# EAGLE design current_monitor_v1 (EAGLE 6.5.0)
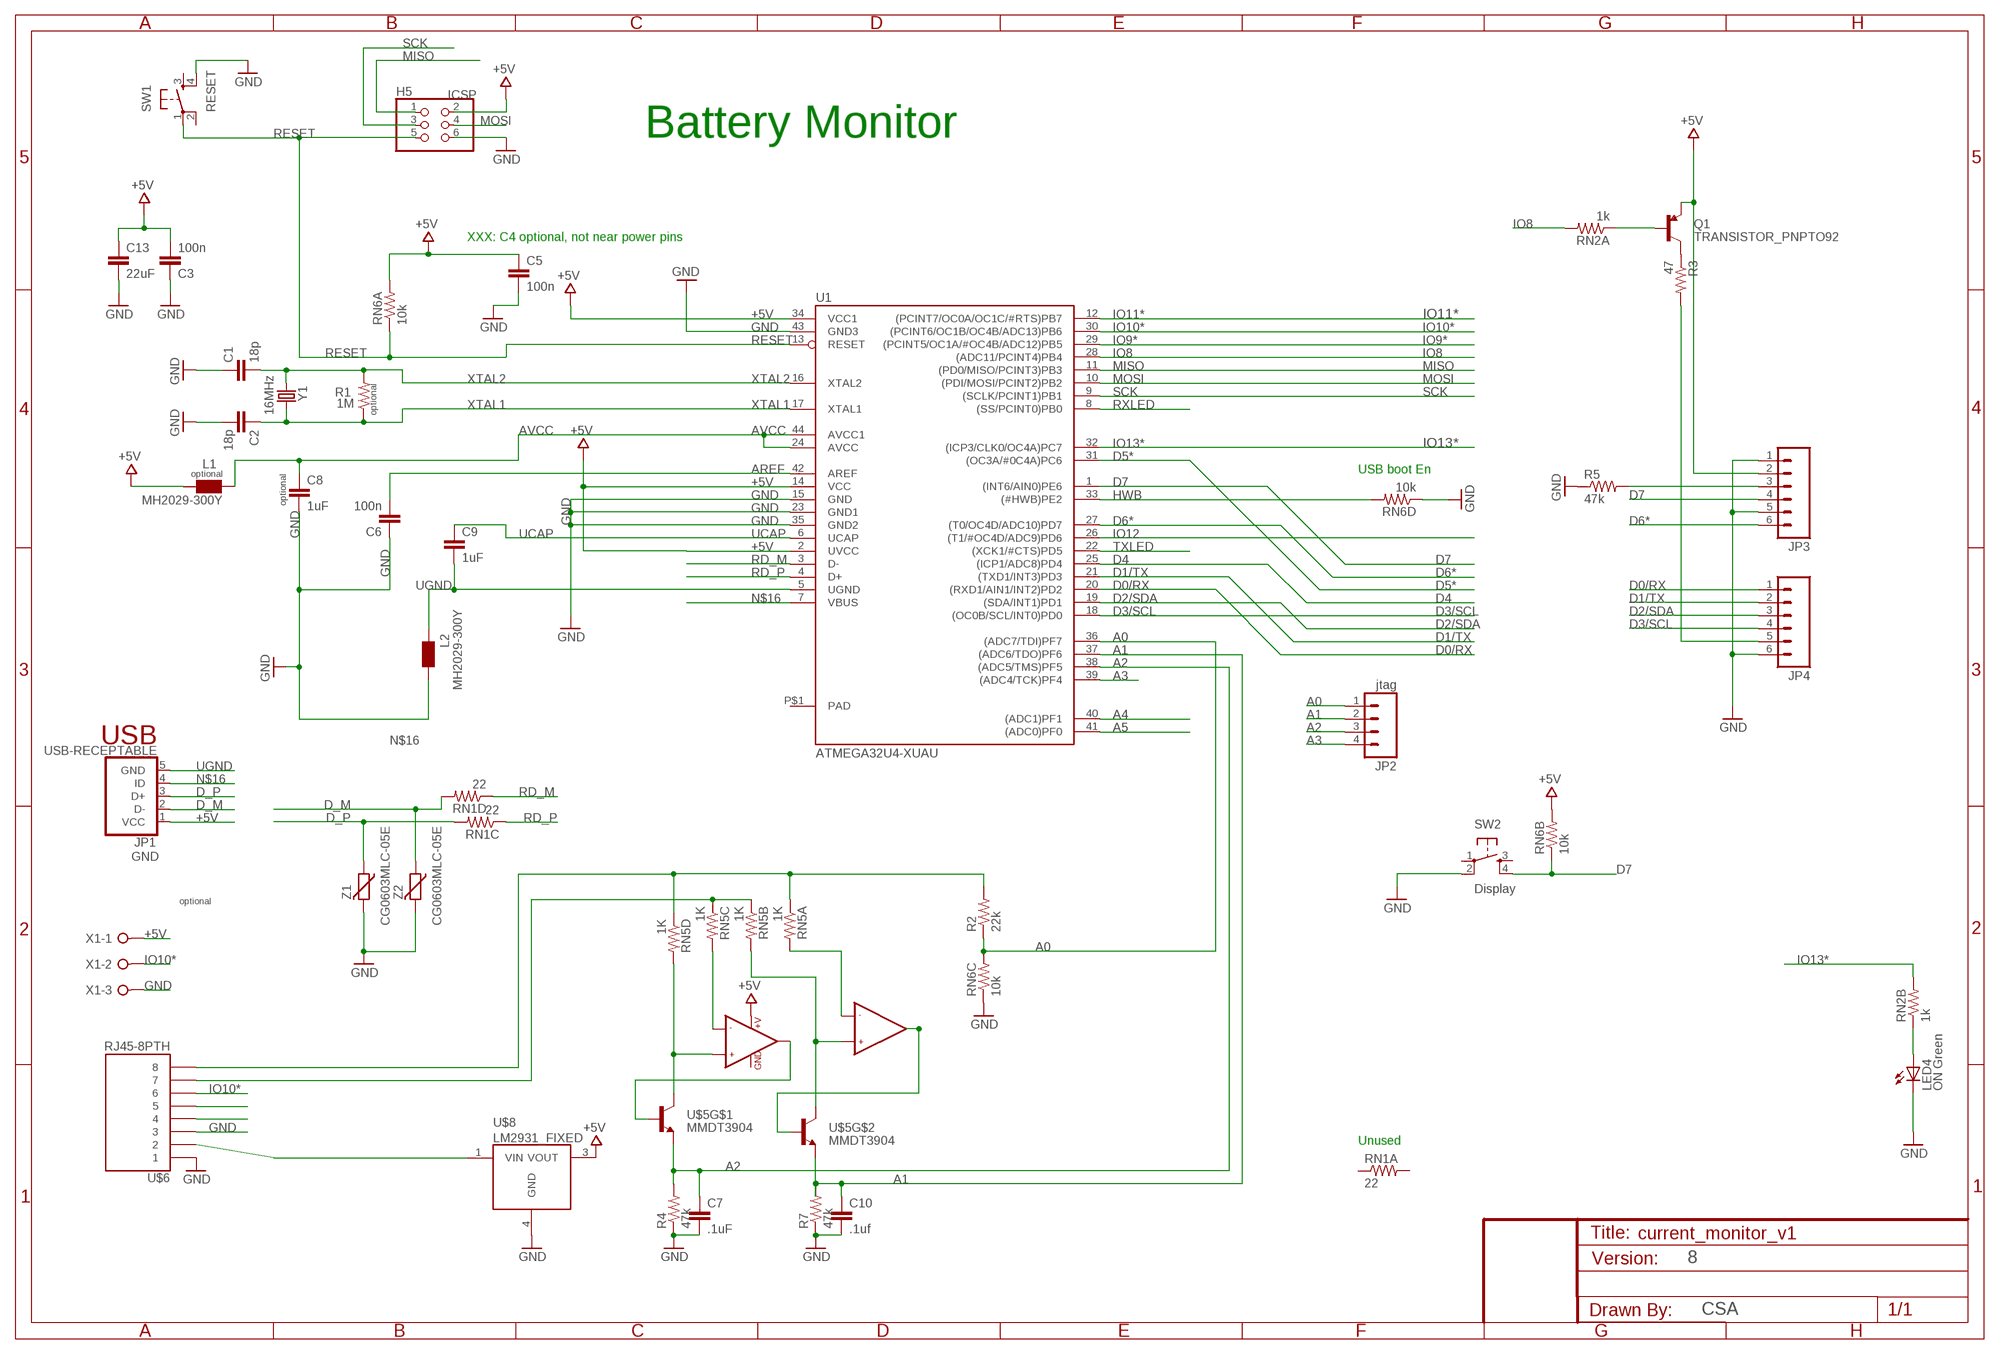
[diagram p0: schematic, sheet 1]

## Parts
C1  18p  CAP0805  [0805]
C2  18p  CAP0805  [0805]
C3  100n  CAP0805  [0805]
C5  100n  CAP0805  [0805]
C6  100n  CAP0805  [0805]
C7  .1uF  CAP0805  [0805]
C8  1uF  CAP0805  [0805]
C9  1uF  CAP0805  [0805]
C10  .1uf  CAP0805  [0805]
C13  22uF  CAP1206  [1206]
H5  ICSP  PINHD-2X3  [2X03]
JP1  USB-RECEPTABLE  [FCI-10103594-0001LF]
JP2  jtag  M04LOCK  [1X04_LOCK]
JP3  M06POGOPIN_HOLES_ONLY  [1X06_HOLES_ONLY]
JP4  M06POGOPIN_HOLES_ONLY  [1X06_HOLES_ONLY]
L1  MH2029-300Y  WE-CBF_0805  [0805]
L2  MH2029-300Y  WE-CBF_0805  [0805]
LED4  ON Green  LED0805  [LED0805]
Q1  TRANSISTOR_PNPTO92  [TO-92]
R1  1M  RESISTOR0805-RES  [0805]
R2  22k  RESISTOR0805-RES  [0805]
R3  47  R-US_0207/15  [0207/15]
R4  47k  RESISTOR0805-RES  [0805]
R5  47k  RESISTOR0805-RES  [0805]
R7  47k  RESISTOR0805-RES  [0805]
RN1  22  RESISTOR-ARRAYCRA06S  [CRA06S]
RN2  1k  RESISTOR-ARRAYCRA06S  [CRA06S]
RN5  1K  RESISTOR-ARRAYCRA06S  [CRA06S]
RN6  10k  RESISTOR-ARRAYCRA06S  [CRA06S]
SW1  RESET  TAC_SWITCHPTH  [TACTILE-PTH]
SW2  Display  TAC_SWITCHPTH  [TACTILE-PTH]
U1  ATMEGA32U4-XUAU  [TQFP44-PAD]
U$2  LMV358  [SO08]
U$5  MMDT3904  [SOT363]
U$6  RJ45-8PTH  [RJ45-8]
U$8  LM2931_FIXED  [DPAK]
X1  W237-03P  [W237-133]
Y1  16MHz  CRYSTALHC49US  [HC49US]
Z1  CG0603MLC-05E  VARISTORCN0603  [CT/CN0603]
Z2  CG0603MLC-05E  VARISTORCN0603  [CT/CN0603]

## Nets
+5V [power]: C3.2 C5.1 C13.1 H5.2 JP1.1(VCC) JP3.2 L1.1 Q1.1(E) RN6.7 RN6.8 U1.2(UVCC) U1.14(VCC) U1.34(VCC1) U$2.8(+V) U$8.3(VOUT) X1.1
A0: JP2.1 R2.1 RN6.6 U1.36((ADC7/TDI)PF7)
A1: C10.1 JP2.2 R7.2 U1.37((ADC6/TDO)PF6) U$5.1(E)
A2: C7.1 JP2.3 R4.2 U1.38((ADC5/TMS)PF5) U$5.4(E)
A3: JP2.4 U1.39((ADC4/TCK)PF4)
A4: U1.40((ADC1)PF1)
A5: U1.41((ADC0)PF0)
AREF [aref]: C6.2 U1.42(AREF)
AVCC: C8.1 L1.2 U1.24(AVCC) U1.44(AVCC1)
D0/RX: JP4.1 U1.20((RXD1/AIN1/INT2)PD2)
D1/TX: JP4.2 U1.21((TXD1/INT3)PD3)
D2/SDA: JP4.3 U1.19((SDA/INT1)PD1)
D3/SCL: JP4.4 U1.18((OC0B/SCL/INT0)PD0)
D4: U1.25((ICP1/ADC8)PD4)
D5*: U1.31((OC3A/#0C4A)PC6)
D6*: JP3.6 U1.27((T0/OC4D/ADC10)PD7)
D7: JP3.4 RN6.2 SW2.4 U1.1((INT6/AIN0)PE6)
D_M: JP1.2(D-) RN1.5 Z2.1
D_P: JP1.3(D+) RN1.6 Z1.1
GND [gnd]: C1.1 C2.2 C3.1 C5.2 C6.1 C7.2 C8.2 C10.2 C13.2 H5.6 JP3.1 JP3.5 JP4.6 L2.2 LED4.C R4.1 R5.1 R7.1 RN6.3 RN6.4 SW1.4 SW2.2 U1.15(GND) U1.23(GND1) U1.35(GND2) U1.43(GND3) U$6.1 U$6.3 U$8.4(GND) X1.3 Z1.2 Z2.2
HWB: RN6.5 U1.33((#HWB)PE2)
IO8: RN2.8 U1.28((ADC11/PCINT4)PB4)
IO9*: U1.29((PCINT5/OC1A/#OC4B/ADC12)PB5)
IO10*: U1.30((PCINT6/OC1B/OC4B/ADC13)PB6) U$6.6 X1.2
IO11*: U1.12((PCINT7/OC0A/OC1C/#RTS)PB7)
IO12: U1.26((T1/#OC4D/ADC9)PD6)
IO13*: RN2.7 U1.32((ICP3/CLK0/OC4A)PC7)
LED4_ANODE: LED4.A RN2.2
MISO: H5.1 U1.11((PD0/MISO/PCINT3)PB3)
MOSI: H5.4 U1.10((PDI/MOSI/PCINT2)PB2)
N$1: RN5.5 U$2.3(+IN1) U$5.3(C)
N$2: RN5.8 U$2.6(-IN2)
N$3: RN5.7 U$2.5(+IN2) U$5.6(C)
N$4: U$2.1(OUT1) U$5.5(B)
N$5: U$2.7(OUT2) U$5.2(B)
N$6: RN5.6 U$2.2(-IN1)
N$7: R2.2 RN5.1 RN5.4 U$6.8
N$8: RN5.2 RN5.3 U$6.7
N$10: Q1.3(C) R3.1
N$12: JP3.3 R5.2
N$13: JP4.5 R3.2
N$16 [power]: JP1.4(ID) U1.7(VBUS)
N$18: U$6.2 U$8.1(VIN)
N$19: Q1.2(B) RN2.1
N$20: U$6.5
N$31 [gnd]: U$6.4
RD_M: RN1.4 U1.3(D-)
RD_P: RN1.3 U1.4(D+)
RESET: H5.5 RN6.1 SW1.1 U1.13(RESET)
RXLED: U1.8((SS/PCINT0)PB0)
SCK: H5.3 U1.9((SCLK/PCINT1)PB1)
TXLED: U1.22((XCK1/#CTS)PD5)
UCAP: C9.1 U1.6(UCAP)
UGND [gnd]: C9.2 JP1.5(GND) L2.1 U1.5(UGND)
XTAL1: C2.1 R1.1 U1.17(XTAL1) Y1.2
XTAL2: C1.2 R1.2 U1.16(XTAL2) Y1.1
Unconnected: RN1.1 RN1.2 RN1.7 RN1.8 RN2.3 RN2.4 RN2.5 RN2.6 SW1.2 SW1.3 SW2.1 SW2.3

## Notes on the sheet
- Battery Monitor
- XXX: C4 optional, not near power pins
- optional
- USB boot En
- optional
- optional
- USB
- optional
- Unused
- 8
- CSA

## Power pins joined to a net without a drawn wire
GND: U$2.4(GND)
PAD: U1.P$1(PAD)

## Library data of the parts
C1-C3 C5 C6 C8 C9 C13 = SparkFun-Passives:CAP: Capacitor Standard 0603 ceramic capacitor, and 0.1" leaded capacitor.
C7 C10 = SparkFun-Capacitors:CAP: Capacitor Standard 0603 ceramic capacitor, and 0.1" leaded capacitor.
H5 = SmartPrj:PINHD-2X3: PIN HEADER
JP1 = daspilker:USB-RECEPTABLE: USB Receptable
JP2 = SparkFun-Connectors:M04: Header 4 Standard 4-pin 0.1" header. Use with straight break away headers (SKU : PRT-00116), right angle break away headers (PRT-00553), swiss pins (PRT-00743), machine pins (PRT-00117), and female headers (PRT-00115). Molex polarized connector foot print use with SKU : PRT-08231 with associated crimp pins and housings. 1MM SMD Version SKU: PRT-10208
JP3 JP4 = SparkFun-Connectors:M06: Header 6 Standard 6-pin 0.1" header. Use with straight break away headers (SKU : PRT-00116), right angle break away headers (PRT-00553), swiss pins (PRT-00743), machine pins (PRT-00117), and female headers (PRT-00115). Molex polarized connector foot print use with SKU : PRT-08094 with associated crimp pins and housings. NOTES ON THE VARIANTS LOCK and LOCK_LONGPADS... This footprint was designed to help hold the alignment of a through-hole component (i.e. 6-pin header) while soldering it into place. You may notice that each hole has been shifted either up or down by 0.005 of an inch from it's more standard position (which is a perfectly straight line). This slight alteration caused the pins (the squares in the middle) to touch the edges of the holes. Because they are alternating, it causes a "brace" to hold the component in place. 0.005 has proven to be the perfect amount of "off-center" position when using our standard breakaway headers. Although looks a little odd when you look at the bare footprint, once you have a header in there, the alteration is very hard to notice. Also, if you push a header all the way into place, it is covered up entirely on the bottom side. This idea of altering the position of holes to aid alignment will be further integrated into the Sparkfun Library for other footprints. It can help hold any component with 3 or more connection pins.
L1 L2 = wuerth-elektronik:WE-CBF: SMD EMI Suppression Ferrite Beads - excellent anti-EMI properties - low DCR - impedances till 3000 ohms - rated current up to 6 A
LED4 = xorduino:LED
Q1 = SparkFun-DiscreteSemi:TRANSISTOR_PNP: Generic PNP BJT. Double check pinouts against datasheets- not all devices are the same!
R1 R2 R4 R5 R7 = SparkFun-Passives:RESISTOR: Resistor Basic schematic elements and footprints for 0603, 1206, and PTH resistors.
R3 = adafruit:R-US_: RESISTOR, American symbol
RN1 RN2 RN5 RN6 = xorduino:RESISTOR-ARRAY
SW1 SW2 = SparkFun-Electromechanical:TAC_SWITCH: Momentary Switch Button commonly used for reset or general input. Spark Fun Electronics SKU : COM-00097
U1 = SmartPrj:ATMEGA32U4-XU
U$2 = SparkFun-AnalogIC:LMV358: Jellybean rail-to-rail output op-amp
U$5 = SparkFun-DiscreteSemi:MMDT3904: Dual NPN transistor
U$6 = SparkFun-Connectors:RJ45-8: RJ45 Jack Simple RJ45, 8-pin connection - connector for common Cat5, Cat5e, and Cat6 Ethernet cables. Footprint not yet proven in production. Connector sku is PRT-00643; Breakout PCB sku is BOB-00716.
U$8 = SparkFun-PowerIC:LM2931_FIXED: LDO regulator with reverse battery protection- very durable!
X1 = con-wago-508:W237-03P: WAGO SREW CLAMP; OC_FARNELL: unknown; OC_NEWARK: unknown
Y1 = SparkFun-FreqCtrl:CRYSTAL: Various standard crystals. Proven footprints. Spark Fun Electronics SKU : COM-00534
Z1 Z2 = varistor:VARISTOR: VARISTOR

## Net classes
0 default: width 0.203 mm, drill 0.406 mm, clearance 0.203 mm
1 power: width 0.203 mm, drill 0.406 mm, clearance 0.203 mm
2 gnd: width 0.203 mm, drill 0.406 mm, clearance 0.203 mm
3 usbvcc: width 0.203 mm, drill 0.406 mm, clearance 0.203 mm
4 aref: width 0.203 mm, drill 0.406 mm, clearance 0.203 mm

## Board
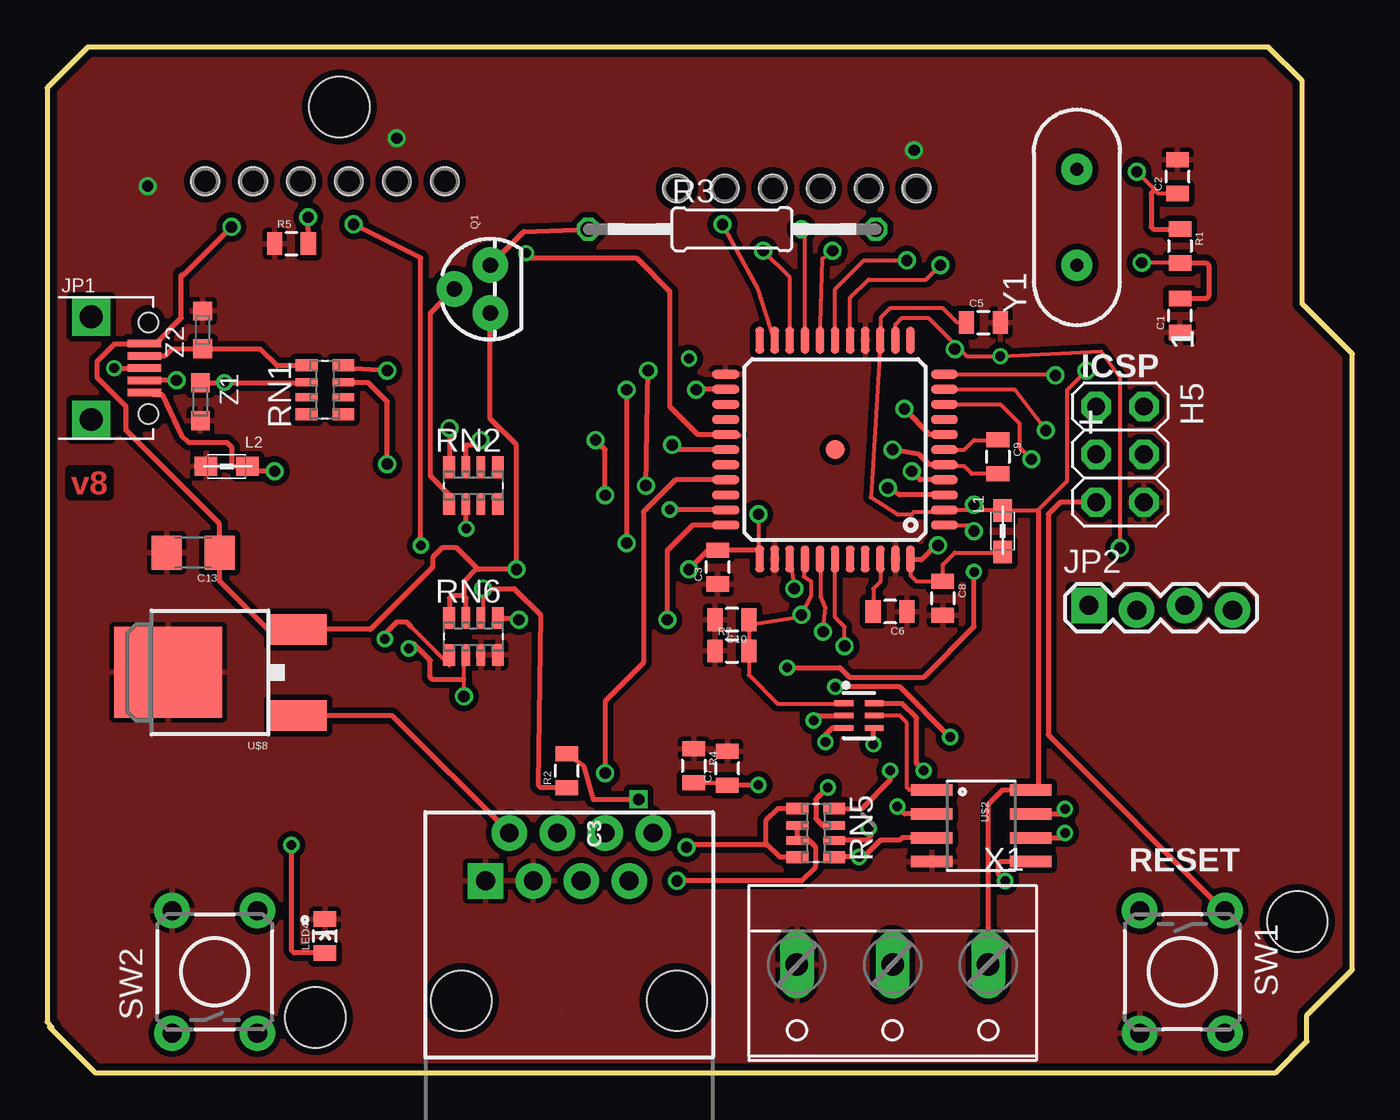
[diagram p1: board, top side]
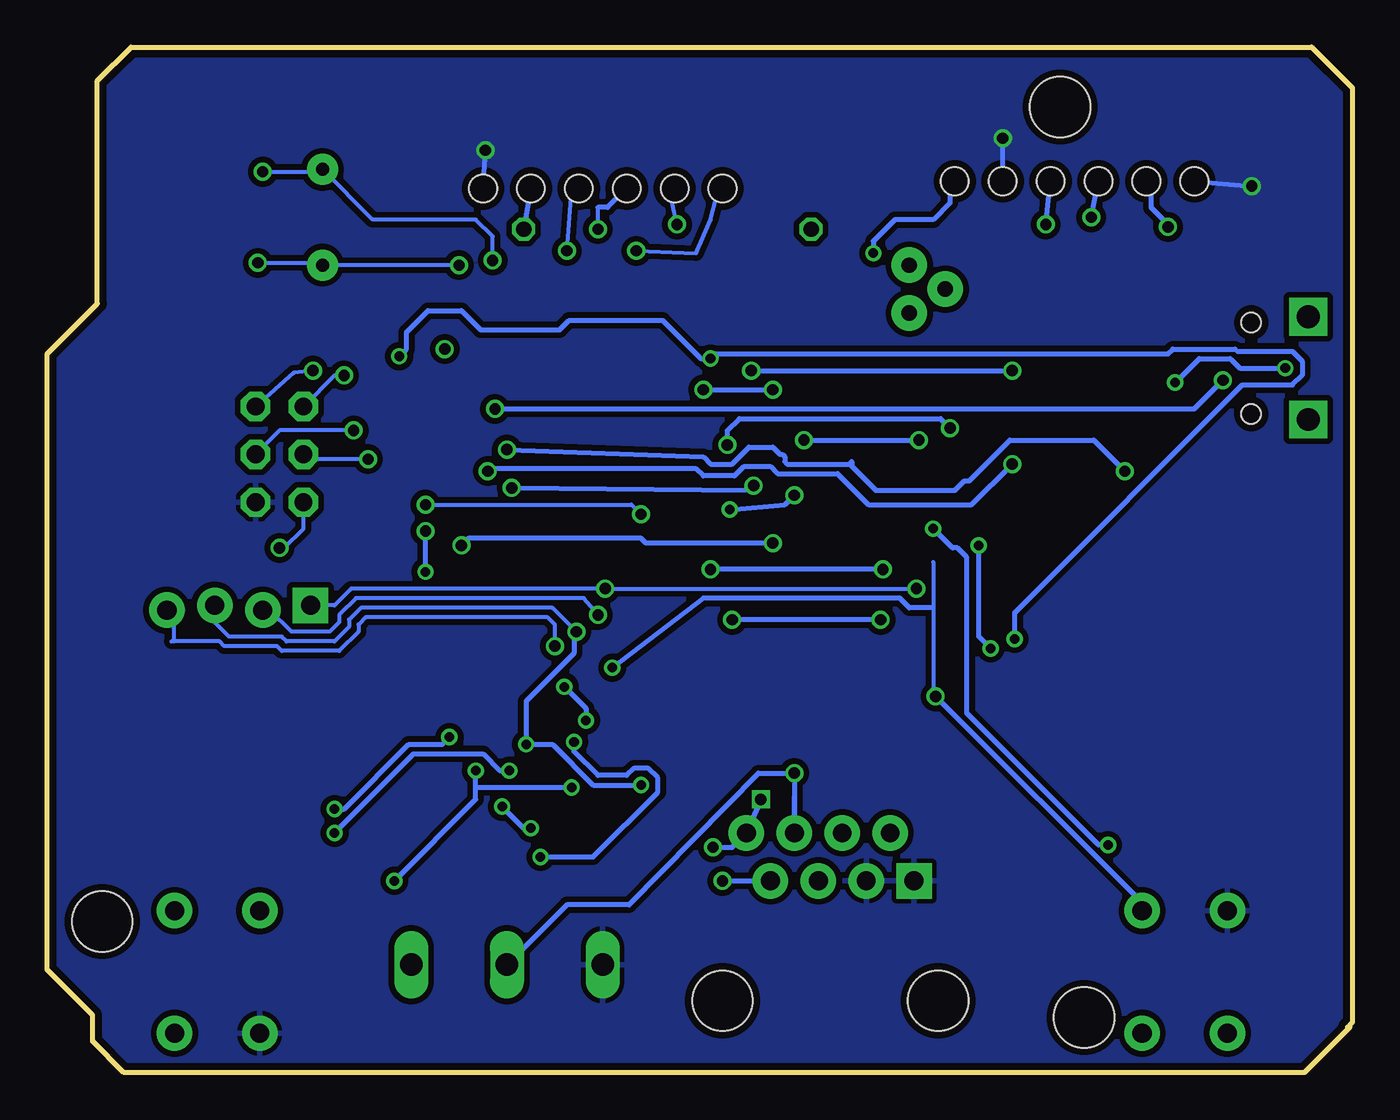
[diagram p2: board, bottom side, seen from below]

Size 69.22 x 54.36 mm. Coordinates in mm from the lower left corner, seen from the top.
Outline: 0.13,2.54 0.13,2.41 2.54,0 65.15,0 66.8,1.65 66.8,3.05 69.22,5.46 69.22,38.1 66.55,40.77 66.55,52.58 64.77,54.36 2.16,54.36 0,52.2 0,2.67 0.25,2.41
Copper layers (1*16): Top 0.0356mm / dielectric 1.5011mm / Bottom 0.0356mm
Design rules "LaenPCBOrder": minimum track width 6mil, minimum drill 13mil, track to track 6mil, track to pad 6mil, pad to pad 6mil, via to via 6mil, smd to smd 6mil, copper to edge 15mil, drill to drill 6mil, minimum pad ring 7mil, minimum via ring 7mil, stop-mask expansion 4mil, vias tented up to drill 0mil, thermal gap 10mil
Holes 3.2 mm at 66.29,8 15.49,51.18 14.22,2.92
tKeepout: area 32.1,28.2 to 62,50.4; area 38,21.7 to 64.4,28.6

### Footprints (pad centres in the part's own frame; a part is rotated, then mirrored left to right if it is on the bottom)
0805 = smd 0.8 x 1.2: 1 -0.9,0; 2 0.9,0
1206 = smd 1.6 x 1.8: 1 -1.4,0; 2 1.4,0
2X03 = drill 0.95 pad 1.55 octagon: 1 -2.54,-1.27; 2 -2.54,1.27; 3 0,-1.27; 4 0,1.27; 5 2.54,-1.27; 6 2.54,1.27
FCI-10103594-0001LF = smd 0.4 x 1.75: 1 -1.3,4.525; 2 -0.65,4.525; 3 0,4.525; 4 0.65,4.525; 5 1.3,4.525 | drill 1.2 pad 2 square: P$3 -2.725,1.7; P$4 2.725,1.7 | hole 1.05: -2.425,4.73; 2.425,4.73
1X04_LOCK = drill 1.016 pad 1.88 square: 1 0,0.127 | drill 1.016 pad 1.88: 2 2.54,-0.127; 3 5.08,0.127; 4 7.62,-0.127
1X06_HOLES_ONLY = drill 0.889 pad 0.813: 1 0,0; 2 2.54,0; 3 5.08,0; 4 7.62,0; 5 10.16,0; 6 12.7,0 | hole 1.473: 0,0; 2.54,0; 5.08,0; 7.62,0; 10.16,0; 12.7,0
0805' = smd 1.2 x 1: 1 -1.1,0; 2 1.1,0
LED0805 = smd 0.8 x 1.2: A -0.9,0; C 0.9,0
TO-92 = drill 0.813 pad 1.88: 1 -1.27,0; 2 0,1.905; 3 1.27,0
0207/15 = drill 0.813 octagon: 1 -7.62,0; 2 7.62,0
CRA06S = smd 0.63 x 1.15: 1 -1.295,-0.975; 4 1.295,-0.975; 5 1.295,0.975; 8 -1.295,0.975 | smd 0.44 x 1.15: 2 -0.4,-0.975; 3 0.4,-0.975; 6 0.4,0.975; 7 -0.4,0.975
TACTILE-PTH = drill 1.016 pad 1.88: 1 -3.251,2.261; 2 3.251,2.261; 3 -3.251,-2.261; 4 3.251,-2.261
TQFP44-PAD = smd 1.4 x 0.45: 1 -5.8,4; 2 -5.8,3.2; 3 -5.8,2.4; 4 -5.8,1.6; 5 -5.8,0.8; 6 -5.8,0; 7 -5.8,-0.8; 8 -5.8,-1.6; 9 -5.8,-2.4; 10 -5.8,-3.2; 11 -5.8,-4; 23 5.8,-4; 24 5.8,-3.2; 25 5.8,-2.4; 26 5.8,-1.6; 27 5.8,-0.8; 28 5.8,0; 29 5.8,0.8; 30 5.8,1.6; 31 5.8,2.4; 32 5.8,3.2; 33 5.8,4 | smd 0.45 x 1.4: 12 -4,-5.8; 13 -3.2,-5.8; 14 -2.4,-5.8; 15 -1.6,-5.8; 16 -0.8,-5.8; 17 0,-5.8; 18 0.8,-5.8; 19 1.6,-5.8; 20 2.4,-5.8; 21 3.2,-5.8; 22 4,-5.8; 34 4,5.8; 35 3.2,5.8; 36 2.4,5.8; 37 1.6,5.8; 38 0.8,5.8; 39 0,5.8; 40 -0.8,5.8; 41 -1.6,5.8; 42 -2.4,5.8; 43 -3.2,5.8; 44 -4,5.8 | smd 1 x 1: P$1 0,0
SO08 = smd 0.61 x 2.21: 1 -1.905,-2.616; 2 -0.635,-2.616; 3 0.635,-2.616; 4 1.905,-2.616; 5 1.905,2.616; 6 0.635,2.616; 7 -0.635,2.616; 8 -1.905,2.616
SOT363 = smd 0.3 x 0.99: 1 -0.65,-0.8; 2 0,-0.8; 3 0.65,-0.8; 4 0.65,0.81; 5 0,0.81; 6 -0.65,0.81
RJ45-8 = drill 1 pad 1.88 square: 1 -4.445,6.35 | drill 1 pad 1.88: 2 -3.175,8.89; 3 -1.905,6.35; 4 -0.635,8.89; 5 0.635,6.35; 6 1.905,8.89; 7 3.175,6.35; 8 4.445,8.89 | hole 3.2: -5.715,0; 5.715,0
DPAK = smd 1.6 x 3: 1 -2.28,-5.31; 3 2.28,-5.31 | smd 4.826 x 5.715: 4 0,1.588
W237-133 = drill 1.194 long: 1 -5.08,-0.635; 2 0,-0.635; 3 5.08,-0.635
HC49US = drill 0.7 pad 1.651: 1 -2.54,0; 2 2.54,0
CT/CN0603 = smd 1 x 1: 1 -1,0; 2 1,0

### Placement (x,y rotation side)
C1  60.07,40.13 90 top
C2  59.94,47.5 90 top
C3  35.56,26.8 90 top
C5  49.66,39.75 0 top
C6  44.7,24.43 180 top
C7  36.07,16.13 90 top
C8  47.5,25.15 270 top
C9  50.42,32.64 270 top
C10  36.32,24 180 top
C13  7.75,27.56 180 top
H5  56.9,32.77 270 top
JP1  0.63,37.34 270 top
JP2  55.25,24.64 0 top
JP3  8.38,47.24 0 top
JP4  33.4,46.86 0 top
L1  MH2029-300Y  [0805']  50.67,28.7 270 top
L2  MH2029-300Y  [0805']  9.53,32.13 180 top
LED4  14.73,7.24 90 top
Q1  23.5,41.53 90 top
R1  60.07,43.81 270 top
R2  27.56,16 90 top
R3  36.32,44.7 0 top
R4  34.29,16.26 270 top
R5  12.95,43.94 0 top
R7  36.32,22.35 0 top
RN1  14.73,36.2 90 top
RN2  22.61,31.12 0 top
RN5  40.77,12.7 270 top
RN6  22.61,23.11 0 top
SW1  60.2,5.33 270 top
SW2  8.89,5.33 90 top
U1  41.78,33.02 180 top
U$2  49.53,13.08 270 top
U$5  43.05,18.92 270 top
U$6  27.69,3.81 0 top
U$8  8,21.21 90 top
X1  44.83,5.08 180 top
Y1  54.61,45.34 90 top
Z1  8.13,35.56 270 top
Z2  8.26,39.37 90 top

### Tracks (layer width: path | path; a pad name or v marks a point on that pad's centre or on a via)
+5V  (via drill 0.6)
  Top 0.203: C5.1 48.26,39.75 47.5,40.51 44.7,40.51 44.2,40.01 44.2,38.83 U1.14 43.68,30.49 45.09,29.59 45.85,29.59 45.97,29.72 47.48,29.72 U1.2 47.6,29.8 49.15,29.8 L1.1 52.53,29.8 54.1,31.37 54.1,36.2 v55.12,37.21 | v37.72,29.59 37.72,27.69 37.72,27.28 U1.34
  Top 0.254: X1.1 49.91,14.22 50.67,14.99 U$2.8 52.58,14.99 52.58,29.72 52.53,29.8 | 22.1,25.27 21.46,25.27 21.34,25.15 21.34,24.13 RN6.8 | 22.1,25.27 22.23,25.15 22.23,24.13 RN6.7 | 35.56,27.69 37.72,27.69 U1.34 | 22.1,25.27 22.1,26.04 22.73,26.67 22.86,26.67 | 22.86,26.67 v24.89,26.67 24.89,33.27 23.5,34.67 Q1.1 | 35.56,27.69 35.05,27.69 v34.04,26.67 | 35.56,27.69 C3.2 | v49.15,30.1 49.15,29.8 | C13.1 9.14,26.04 11.68,23.5 13.21,23.5 U$8.3 13.33,23.5 17.15,23.5 20.45,26.8 20.45,27.3 20.96,27.81 21.72,27.81 22.86,26.67 | C13.1 9.14,29.08 4.19,34.04 4.19,35.31 2.67,36.83 2.67,37.72 3.56,38.61 5.08,38.61 JP1.1 5.74,38.64 7.11,40.01 7.11,42.29 7.24,42.29 v9.78,44.83 | C13.1
  Bottom 0.203: v55.12,37.21 56.13,37.08 H5.2 | v37.72,29.59 38.23,30.1 v49.15,30.1
  Bottom 0.254: v24.89,26.67 v34.04,26.67 | v9.78,44.83 9.78,44.96 10.67,45.85 10.67,46.99 JP3.2
A0  (via drill 0.6)
  Top 0.203: JP2.1 55.37,24.77 55.5,24.89 | U1.36 39.64,25.67 v39.62,25.65 | v23.11,25.65 23.11,24.2 RN6.6
  Top 0.254: v23.11,25.65 24.77,25.65 26.16,24.26 26.04,15.24 26.16,15.11 27.56,15.11 R2.1
  Bottom 0.203: v23.11,25.65 v39.62,25.65 53.09,25.65 53.98,24.77 JP2.1
A1  (via drill 0.6)
  Top 0.203: U1.37 40.13,27.18 40.13,26.29 40.51,26.04 40.51,25.27 v40.01,24.26 39.75,24.13 37.21,23.75 C10.1 R7.2 37.21,22.35 37.21,21.08 38.73,19.56 42.16,19.56 U$5.1
  Bottom 0.203: v40.01,24.26 40.77,25.15 52.83,25.15 53.72,24.26 53.72,23.88 54.23,23.37 56.26,23.37 57.4,24.51 JP2.2
A2  (via drill 0.51, 0.6)
  Top 0.203: U1.38 41.02,27.18 41.02,25.27 41.27,24.64 v41.15,23.37 | R4.2 35.94,15.36 C7.1
  Top 0.254: v43.82,17.4 43.82,18.16 U$5.4 | v37.72,15.24 C7.1
  Bottom 0.203: v41.15,23.37 42.42,24.64 52.58,24.64 53.21,24 53.21,23.62 53.98,22.86 56.52,22.86 56.77,23.11 59.56,23.11 60.33,23.88 JP2.3
  Bottom 0.254: v41.15,23.37 41.27,23.37 41.27,22.23 43.82,19.68 v43.82,17.4 42.42,17.4 40.26,15.24 v37.72,15.24
A3  (via drill 0.6)
  Top 0.203: U1.39 41.78,24.13 42.29,23.62 v42.29,22.61
  Bottom 0.203: 61.98,24.51 62.48,24.51 | 62.48,22.86 60.07,22.86 59.82,22.61 57.02,22.61 56.77,22.35 53.72,22.35 52.7,23.37 52.7,23.75 52.32,24.13 42.67,24.13 42.29,23.75 v42.29,22.61 | 62.48,22.86 62.61,22.86 | 62.48,22.86 62.48,24.51 | 62.48,24.51 JP2.4
AREF
  Top 0.203: U1.42 44.18,26.02 43.82,25.65 43.82,24.45 C6.2
AVCC  (via drill 0.6)
  Top 0.203: L1.2 50.38,27.56 48.13,27.56 47.5,26.92 C8.1 46.1,26.04 45.78,26.35 U1.44
  Top 0.254: U1.24 34.82,36.22 v34.42,36.2 | v30.73,36.2 v30.73,28.07 | v47.24,27.94 47.12,27.94 46.36,27.18 45.83,27.18 U1.44
  Bottom 0.254: v34.42,36.2 v30.73,36.2 | v30.73,28.07 37.47,28.07 37.72,28.32 46.86,28.32 v47.24,27.94
D0/RX  (via drill 0.6)
  Top 0.203: U1.20 39.38,42.15 v37.97,43.56
  Bottom 0.203: v37.97,43.56 34.8,43.43 34.04,45.21 33.66,46.61
  Bottom 0.254: JP4.1 33.65,46.61 33.66,46.61
D1/TX  (via drill 0.6)
  Top 0.203: U1.21 37.69,41.55 v35.81,44.96
  Bottom 0.203: v35.81,44.96 36.2,46.61
  Bottom 0.254: JP4.2 36.19,46.61 36.2,46.61
D2/SDA  (via drill 0.6)
  Top 0.203: U1.19 40.18,44.53 v40.01,44.7
  Bottom 0.203: v40.01,44.7 40.01,45.86
  Bottom 0.254: JP4.3 39.49,45.86 40.01,45.86
D3/SCL  (via drill 0.6)
  Top 0.203: U1.18 41.11,43.14 v41.66,43.56
  Bottom 0.203: v41.66,43.56 41.4,46.74
  Bottom 0.254: JP4.4 41.15,46.74 41.4,46.74
D6*  (via drill 0.51)
  Top 0.254: 36.7,33.78 36.07,33.78 U1.27 34.51,33.82 33.02,35.31 33.02,41.4 31.24,43.18 25.65,43.18 v25.4,43.43
  Bottom 0.254: v25.4,43.43 25.4,44.07 24.26,45.21 22.23,45.21 21.34,46.1 21.34,46.86 JP3.6
D7  (via drill 0.51, 0.6)
  Top 0.203: U1.1 48.96,29.02 v49.15,28.7 | v22.1,19.94 22.1,20.83 22.1,22.03 RN6.2
  Top 0.254: 22.1,20.83 20.45,20.83 20.32,20.96 20.32,21.84 19.43,22.73 v19.18,22.48 | v49.15,26.54 49.15,23.62 46.48,20.96 42.55,20.96 42.04,21.46 v39.24,21.46 | v19.81,27.94 19.81,43.18 v16.26,44.96
  Bottom 0.203: 22.23,27.05 22.23,24.64 22.23,20.07 v22.1,19.94
  Bottom 0.254: v22.1,19.94 11.18,9.02 11.18,8.64 SW2.4 | v49.15,26.54 v49.15,28.7 | v39.24,21.46 34.42,25.15 24,25.15 23.5,24.64 22.23,24.64 | v19.81,27.94 19.81,23.11 v19.18,22.48 | v16.26,44.96 JP3.4
D_M
  Top 0.254: 8.26,38.35 11.3,38.35 12.19,37.47 13.72,37.47 RN1.5 | 8.26,38.35 6.6,38.35 6.22,37.97 5.21,37.97 JP1.2 | 8.26,38.35 Z2.1
D_P  (via drill 0.51)
  Top 0.254: RN1.6 13.72,36.58 v9.4,36.58 8.13,36.58 Z1.1 | v3.56,37.34 JP1.3
  Bottom 0.254: v3.56,37.34 5.97,37.34 6.48,37.85 8.13,37.85 v9.4,36.58
GND  (via drill 0.6)
  Bottom 0.254: JP3.1 v5.33,46.99 | JP3.5 v18.54,49.53 | JP4.6 v45.97,48.9
  pour Bottom (isolate 0.305): 0.25,1.65 0.25,52.45 1.52,53.72 65.02,53.72 66.29,52.45 66.29,41.02 68.83,38.48 68.83,5.46 66.29,2.92 66.29,1.65 65.02,0.38 2.79,0.38
  pour Top (isolate 0.305): 0.25,1.65 0.25,52.45 1.52,53.72 65.02,53.72 66.29,52.45 66.29,41.02 68.83,38.48 68.83,5.46 66.29,2.92 66.29,1.65 64.52,0.38 2.29,0.38
HWB  (via drill 0.6)
  Top 0.254: RN6.5 24.93,24.09 v25.02,24 | v32.89,24 32.89,27.69 34.23,29.02 U1.33
  Bottom 0.254: v25.02,24 v32.89,24
IO8  (via drill 0.6)
  Top 0.254: U1.28 33.4,33.02 v33.15,33.27 | v21.34,34.16 21.34,32.12 RN2.8
  Bottom 0.254: v33.15,33.27 33.15,34.04 32.51,34.67 21.84,34.67 v21.34,34.16
IO10*  (via drill 0.6)
  Top 0.254: U1.30 33.33,31.42 31.62,29.72 31.62,21.72 29.59,19.68 v29.59,15.88
  Bottom 0.254: 29.59,14.61 U$6.6 v29.59,15.88 31.5,15.88 38.35,8.89 41.66,8.89 X1.2
IO13*  (via drill 0.51, 0.6)
  Top 0.254: U1.32 36.07,29.84 v33.02,29.84 | v29.59,30.61 29.59,33.02 v29.08,33.53 | RN2.7 22.23,32.11 22.23,33.27 22.73,33.27 v22.99,33.53
  Bottom 0.254: v33.02,29.84 30.1,30.1 v29.59,30.61 | v29.08,33.53 v22.99,33.53
LED4_ANODE  (via drill 0.51)
  Top 0.254: v12.95,12.06 12.95,6.48 13.08,6.35 LED4.A | v22.23,28.83 22.23,30.1 RN2.2
  Bottom 0.254: v12.95,12.06 13.46,12.06 20.45,19.05 20.45,27.3 20.96,27.81 21.21,27.81 v22.23,28.83
MISO  (via drill 0.6)
  Top 0.203: U1.11 53.4,37.02 v53.47,36.96
  Bottom 0.203: v53.47,36.96 53.98,36.96 H5.1
MOSI  (via drill 0.6)
  Top 0.203: U1.10 51.28,36.22 v52.96,34.04
  Bottom 0.203: v52.96,34.04 56.9,34.04 H5.4
N$1  (via drill 0.51)
  Top 0.254: U$2.3 45.34,12.45 45.21,12.32 44.2,12.32 43.31,11.43 v43.05,11.43 41.78,11.43 RN5.5 | v41.27,17.53 41.27,17.91 41.66,18.29 42.16,18.29 U$5.3
  Bottom 0.254: v41.27,17.53 41.27,17.02 40.01,15.75 38.48,15.75 38.1,16.13 37.34,16.13 36.83,15.62 36.83,14.86 40.26,11.43 v43.05,11.43
N$2  (via drill 0.51)
  Top 0.254: v44.7,16 44.7,15.49 43.18,13.97 41.78,13.97 RN5.8 | v53.98,12.7 53.72,12.45 U$2.6
  Bottom 0.254: v44.7,16 45.21,16 46.1,16.89 49.78,16.89 v53.98,12.7
N$3  (via drill 0.51)
  Top 0.254: v46.48,16 46.1,16.38 46.1,18.8 45.34,19.56 43.94,19.56 U$5.6 | v50.8,10.16 50.42,10.54 50.42,11.05 50.55,11.18 U$2.5 | v41.4,15.11 40.77,14.48 40.77,13.46 41.15,13.08 41.66,13.08 RN5.7
  Bottom 0.254: 46.48,15.11 46.48,14.48 v50.8,10.16 | 46.48,15.11 v46.48,16 | 46.48,15.11 v41.4,15.11
N$4
  Top 0.203: U$5.5 45.21,18.92 45.59,18.54 45.59,15.11 45.72,14.99 U$2.1
N$5  (via drill 0.51)
  Top 0.254: U$5.2 40.89,18.92 v40.64,18.67 | v41.78,20.45 45.21,20.45 v47.88,17.78 | v53.98,13.97 53.72,13.72 U$2.7
  Bottom 0.254: v40.64,18.67 40.64,19.3 v41.78,20.45 | v47.88,17.78 48.26,17.4 50.04,17.4 53.47,13.97 v53.98,13.97
N$6  (via drill 0.51)
  Top 0.254: v43.56,12.95 43.69,12.83 43.69,12.57 43.43,12.32 41.78,12.32 RN5.6 | v45.09,14.1 45.47,13.72 U$2.2
  Bottom 0.254: v43.56,12.95 43.94,12.95 v45.09,14.1
N$7  (via drill 0.6)
  Top 0.254: U$6.8 32.13,13.72 | R2.2 28.45,16.26 28.96,14.48 v31.37,14.48 | RN5.1 38.76,14 38.1,13.34 38.1,12.19 | 38.1,12.19 38.86,11.43 39.77,11.43 RN5.4 | 38.1,12.19 38.1,12.06 34.04,12.06 v33.91,11.94
  Bottom 0.254: v31.37,14.48 U$6.8 32.89,11.94 v33.91,11.94
N$8  (via drill 0.6)
  Top 0.254: RN5.2 39.75,13.21 39.62,13.08 39.75,12.95 39.75,12.32 RN5.3 39.88,12.32 40.39,12.32 40.77,11.94 40.77,10.92 40.01,10.16 v33.4,10.16
  Bottom 0.254: v33.4,10.16 U$6.7
N$10
  Top 0.254: R3.1 25.27,44.58 Q1.3
N$12  (via drill 0.6)
  Top 0.254: R5.2 v13.84,45.34
  Bottom 0.254: v13.84,45.34 JP3.3
N$13
  Bottom 0.203: 44.07,44.7 R3.2
  Bottom 0.254: JP4.5 43.56,46.99 R3.2
N$16  (via drill 0.6)
  Top 0.254: U1.7 46.83,33.82 v45.47,35.18 | v6.86,36.7 5.17,36.7 JP1.4
  Bottom 0.254: v45.47,35.18 8.38,35.18 v6.86,36.7
N$18
  Top 0.254: U$6.2 18.29,18.92 13.33,18.92 U$8.1
N$19
  Top 0.254: Q1.2 20.32,40.26 20.32,31.62 21.34,30.61 21.34,30.23 RN2.1
RD_M  (via drill 0.6)
  Top 0.254: U1.3 45.2,30.62 v44.58,30.99 | v31.75,31.12 v31.88,37.21 | v18.03,37.21 15.86,37.34 RN1.4
  Bottom 0.254: v44.58,30.99 32,30.86 v31.75,31.12 | v31.88,37.21 v18.03,37.21
RD_P  (via drill 0.6)
  Top 0.254: U1.4 46.3,31.42 v45.85,31.88 | v18.03,32.26 18.03,35.56 17.02,36.58 15.73,36.58 RN1.3
  Bottom 0.254: v18.03,32.26 20.19,30.1 25.65,30.1 27.3,31.75 30.48,31.75 30.86,32.13 32.26,32.13 32.77,31.62 34.42,31.62 34.8,32 45.72,32 v45.85,31.88
RESET  (via drill 0.51, 0.6)
  Top 0.203: v56.9,27.81 56.9,36.83 55.88,38.23 v50.55,37.97 48.77,37.97 48.2,38.54 46.74,40.01 45.34,40.01 44.98,39.65 U1.13 44.98,38.25 44.96,38.23 | 19.3,23.62 21.34,21.59 21.34,22.11 RN6.1
  Top 0.254: H5.5 53.72,30.23 53.09,29.59 53.09,17.91 62.36,8.64 SW1.1 | v48.13,38.35 48.13,38.48 48.2,38.54 | v17.91,22.99 17.91,23.24 18.54,23.88 19.05,23.88 19.3,23.62
  Bottom 0.203: v56.9,27.81 56.64,27.81 55.63,28.83 H5.5
  Bottom 0.254: v17.91,22.99 17.91,24.38 5.84,36.45 3.18,36.45 2.67,36.96 2.67,37.72 3.18,38.23 6.1,38.23 6.22,38.35 9.53,38.35 9.78,38.1 33.78,38.1 v34.04,37.85 34.54,37.85 36.58,39.88 41.53,39.88 42.04,39.37 46.23,39.37 47.24,40.39 49.02,40.39 50.16,39.24 50.16,38.35 v50.55,37.97
SCK  (via drill 0.6)
  Top 0.203: U1.9 50.56,35.42 51.56,34.42 51.56,33.15 v52.2,32.51
  Bottom 0.203: v52.2,32.51 55.37,32.51 H5.3
UCAP
  Top 0.203: U1.6 48.64,33.02 49.15,33.53 50.41,33.53 C9.1
UGND  (via drill 0.6)
  Top 0.203: C9.2 49.03,31.74 48.64,32.13 47.67,32.13 U1.5
  Top 0.254: JP1.5 5.21,36.07 5.72,35.94 6.1,35.94 7.11,33.78 7.49,33.4 9.53,33.4 9.78,33.15 9.78,32.13 L2.1 10.88,31.88 v12.06,31.88 | U1.5 46.77,32.22 46.23,32.77 v44.83,33.02
  Bottom 0.254: v44.83,33.02 34.42,32.64 34.04,32.26 32.89,32.26 32,33.15 30.73,33.15 30.35,32.77 30.23,32.77 30.1,32.64 30.1,32.38 29.97,32.26 26.67,32.26 26.54,32.38 26.54,32.13 25.27,30.86 21.08,30.86 20.57,31.37 20.32,31.37 18.16,33.53 13.72,33.53 v12.06,31.88
XTAL1  (via drill 0.6)
  Top 0.203: U1.17 41.78,41.53 43.31,43.05 v45.59,43.05 | C2.1 58.94,46.6 58.74,46.8 v57.78,47.75
  Top 0.254: 58.74,46.8 58.55,46.61 58.55,44.83 58.67,44.7 R1.1
  Bottom 0.203: v45.59,43.05 45.59,44.32 46.48,45.21 51.94,45.21 Y1.2 54.74,47.75 v57.78,47.75
XTAL2  (via drill 0.6)
  Top 0.203: U1.16 42.58,41.06 43.56,42.04 46.61,42.04 v47.37,42.8 | R1.2 58.05,42.91 v58.04,42.93
  Top 0.254: C1.2 61.47,41.02 61.59,41.15 61.59,42.8 61.47,42.93 60.07,42.93 R1.2
  Bottom 0.203: v47.37,42.8 Y1.1 54.74,42.93 v58.04,42.93

### Text on the board
Top: v8
tPlace: 1 | ICSP | + | C3 | RESET
tValues: Display | To Battery